# EasyEDA Pro project GigaVGA666PS2.eprj

# Schematic Schematic1
Board Name: Board1; Create Date: 2025-10-13; Page Name: P1; Project Name: GigaVGA666PS2; Schematic Name: Schematic1; Update Date: 2025-10-14; Company: EasyEDA.com; Page Size: A4; Version: V1.0
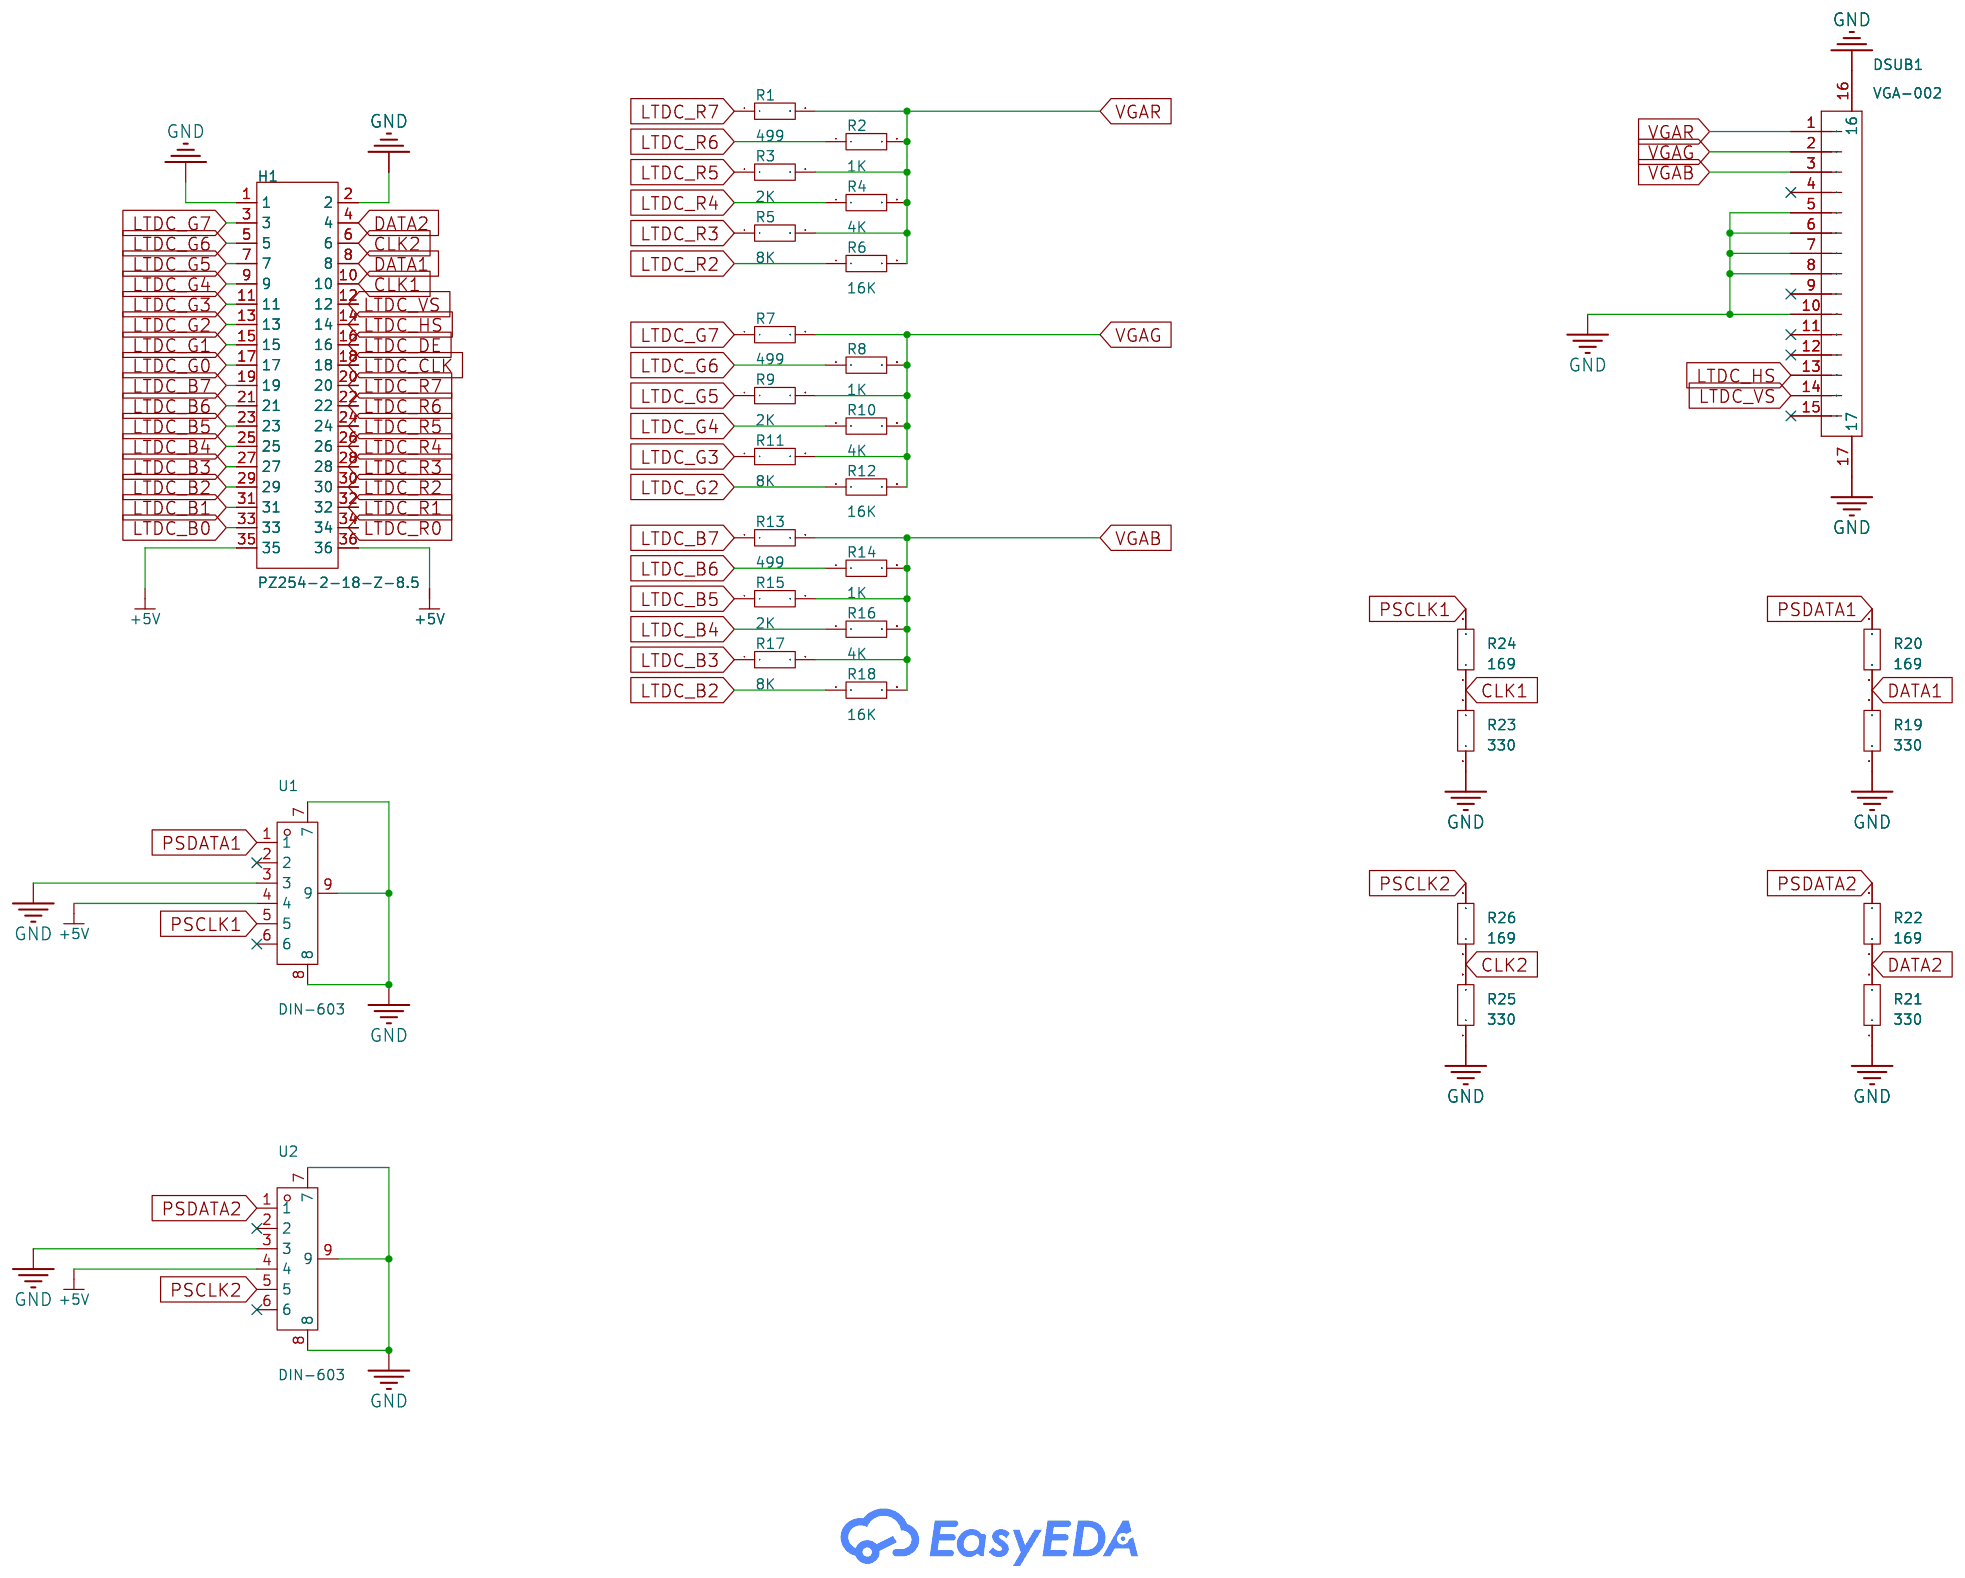
[diagram p0: schematic sheet]

## Parts
DSUB1  VGA-002  [D-SUB-TH_VGA-002]
H1  PZ254-2-18-Z-8.5  [HDR-TH_36P-P2.54-V-M-R2-C18-S2.54]
R1  499  [R0603]
R2  1K  [R0603]
R3  2K  [R0603]
R4  4K  [R0603]
R5  8K  [R0603]
R6  16K  [R0603]
R7  499  [R0603]
R8  1K  [R0603]
R9  2K  [R0603]
R10  4K  [R0603]
R11  8K  [R0603]
R12  16K  [R0603]
R13  499  [R0603]
R14  1K  [R0603]
R15  2K  [R0603]
R16  4K  [R0603]
R17  8K  [R0603]
R18  16K  [R0603]
R19  330  [R0603]
R20  169  [R0603]
R21  330  [R0603]
R22  169  [R0603]
R23  330  [R0603]
R24  169  [R0603]
R25  330  [R0603]
R26  169  [R0603]
U1  DIN-603  [PS2-TH_DIN-603]
U2  DIN-603  [PS2-TH_DIN-603]

## Library data of the parts
DSUB1 = VGA-002: LCSC Part Name: D-Sub 母 P数:15P; Supplier Part: C138387; Manufacturer: BOOMELE(博穆精密); Supplier Footprint: 弯插; JLCPCB Part Class: Extended Part; Datasheet: https://item.szlcsc.com/datasheet/VGA-002/149705.html; Supplier: LCSC; Connector Type: High Density D-Sub; Gender: Female; Number of Pins: 15P; Mounting Type: Right Angle; Number of Rows: 3; Current Rating-Signal: 500mA; Voltage Rating: 30V; Color: Blue
H1 = PZ254-2-18-Z-8.5_C2894979: LCSC Part Name: 2x18P 间距:2.54mm 方针 直插; Supplier Part: C2894979; Manufacturer: HCTL(华灿天禄); Supplier Footprint: 插件,P=2.54mm; JLCPCB Part Class: Extended Part; Datasheet: https://atta.szlcsc.com/upload/public/pdf/source/20230609/5BA09C8BEB9B31376F8BF6032FF67CAC.pdf; Supplier: LCSC; Pin Structure: 2x18P; Pitch: 2.54mm; Row Spacing: 2.54mm; Circluar Pins/Square Pins: Policy; Mounting Type: Straight; Number of Rows: Double Row; Number of Pins: 36P; Current Rating: 3A; Length of Mating Pin: 6mm; Insulation Height: 2.5mm; Length of End Connection Pin: 3mm; Contact Material: Brass; Operating Temperature: -40℃~+105℃; Color: Black
R1-R26 = Res_0603: Supplier Footprint: 0603
U1 U2 = DIN-603_C23689424: LCSC Part Name: DIN插座; Supplier Part: C23689424; Manufacturer: Legion(六钧); Supplier Footprint: 插件; JLCPCB Part Class: Extended Part; Datasheet: https://atta.szlcsc.com/upload/public/pdf/source/20240702/0160C5086853E535507D1610542C9395.pdf; Supplier: LCSC

## Nets
+5V: H1.35 H1.36 U1.4 U2.4
GND: DSUB1.5 DSUB1.6 DSUB1.7 DSUB1.8 DSUB1.10 DSUB1.16 DSUB1.17 H1.1 H1.2 R19.1 R21.1 R23.1 R25.1 U1.3 U1.7 U1.8 U1.9 U2.3 U2.7 U2.8 U2.9
CLK1: H1.10 R23.2 R24.1
CLK2: H1.6 R25.2 R26.1
DATA1: H1.8 R19.2 R20.1
DATA2: H1.4 R21.2 R22.1
LTDC_B0: H1.33
LTDC_B1: H1.31
LTDC_B2: H1.29 R18.1
LTDC_B3: H1.27 R17.1
LTDC_B4: H1.25 R16.1
LTDC_B5: H1.23 R15.1
LTDC_B6: H1.21 R14.1
LTDC_B7: H1.19 R13.1
LTDC_CLK: H1.18
LTDC_DE: H1.16
LTDC_G0: H1.17
LTDC_G1: H1.15
LTDC_G2: H1.13 R12.1
LTDC_G3: H1.11 R11.1
LTDC_G4: H1.9 R10.1
LTDC_G5: H1.7 R9.1
LTDC_G6: H1.5 R8.1
LTDC_G7: H1.3 R7.1
LTDC_HS: DSUB1.13 H1.14
LTDC_R0: H1.34
LTDC_R1: H1.32
LTDC_R2: H1.30 R6.1
LTDC_R3: H1.28 R5.1
LTDC_R4: H1.26 R4.1
LTDC_R5: H1.24 R3.1
LTDC_R6: H1.22 R2.1
LTDC_R7: H1.20 R1.1
LTDC_VS: DSUB1.14 H1.12
PSCLK1: R24.2 U1.5
PSCLK2: R26.2 U2.5
PSDATA1: R20.2 U1.1
PSDATA2: R22.2 U2.1
VGAB: DSUB1.3 R13.2 R14.2 R15.2 R16.2 R17.2 R18.2
VGAG: DSUB1.2 R7.2 R8.2 R9.2 R10.2 R11.2 R12.2
VGAR: DSUB1.1 R1.2 R2.2 R3.2 R4.2 R5.2 R6.2

Not connected (* = marked no-connect by the designer): DSUB1 4* 9* 11* 12* 15*; U1 2* 6*; U2 2* 6*

# Board PCB1
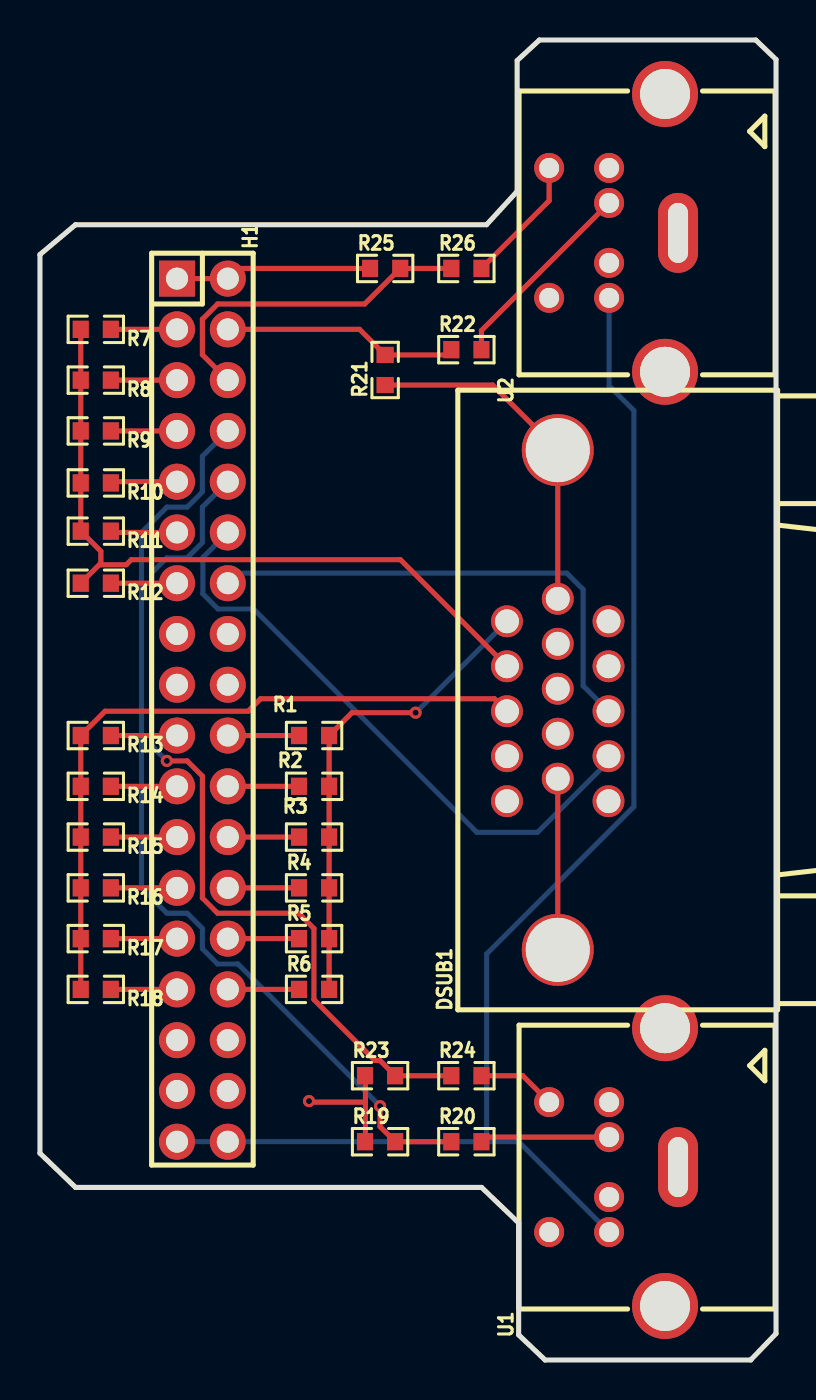
[diagram p1: board, top side]
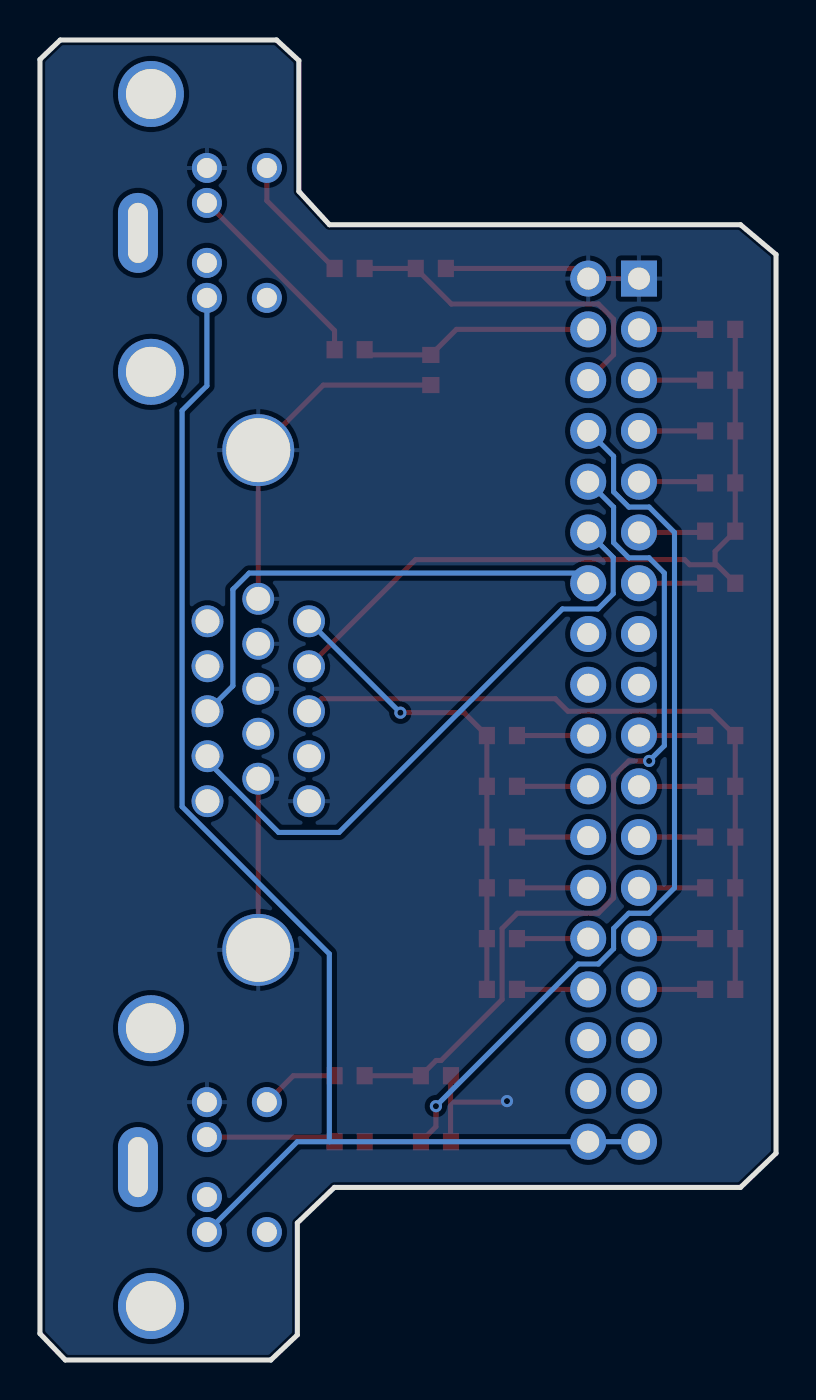
[diagram p2: board, bottom side, seen from below]

Outline 36.83 x 66.04 mm; copper layers: Top Layer, Bottom Layer. Coordinates in mm from the lower left corner of the outline.
Outline path: 0,55.31 1.78,56.8 22.34,56.8 23.88,58.47 23.88,65.01 24.99,66.04 35.81,66.04 36.83,65.06 36.83,1.32 35.56,0 25.28,0 23.95,1.26 23.95,6.86 22.1,8.64 1.78,8.64 0,10.34 0,55.31
Stack: Top Layer 0.035mm / Dielectric1 1.51mm FR4 er 4.5 / Bottom Layer 0.035mm

## Design rules (mm)
template: Custom Config
spacing copperThickness1oz (default): track to track 0.102, other pairs 0.152 to 0.3
spacing copperThickness2oz: track to track 0.203, other pairs 0.152 to 0.3
track width copperThickness1oz (default): min 0.127, default 0.254, max 2.54
track width copperThickness2oz: min 0.127, default 0.254, max 2.54
differential pair differentialPair (default): width min 0.127, default 0.254, max 2.54; gap min 0.152, default 0.152
via viaSize (default): diameter min 0.5, default 0.61, max 10; hole min 0.3, default 0.305, max 6.3
net GND uses copperThickness2oz

## Placement (name value [footprint] x y rotation side)
DSUB1  VGA-002  [D-SUB-TH_VGA-002]  25.91 33.02 90 top
H1  PZ254-2-18-Z-8.5  [HDR-TH_36P-P2.54-V-M-R2-C18-S2.54]  8.13 32.51 270 top
R1  499  [R0603]  13.72 31.24 0 top
R2  1K  [R0603]  13.72 28.7 0 top
R3  2K  [R0603]  13.72 26.16 0 top
R4  4K  [R0603]  13.72 23.62 0 top
R5  8K  [R0603]  13.72 21.08 0 top
R6  16K  [R0603]  13.72 18.54 0 top
R7  499  [R0603]  2.79 51.56 180 top
R8  1K  [R0603]  2.79 49.02 180 top
R9  2K  [R0603]  2.79 46.48 180 top
R10  4K  [R0603]  2.79 43.88 180 top
R11  8K  [R0603]  2.79 41.47 180 top
R12  16K  [R0603]  2.79 38.86 180 top
R13  499  [R0603]  2.79 31.24 180 top
R14  1K  [R0603]  2.79 28.7 180 top
R15  2K  [R0603]  2.79 26.16 180 top
R16  4K  [R0603]  2.79 23.62 180 top
R17  8K  [R0603]  2.79 21.08 180 top
R18  16K  [R0603]  2.79 18.54 180 top
R19  330  [R0603]  17.02 10.92 0 top
R20  169  [R0603]  21.34 10.92 0 top
R21  330  [R0603]  17.27 49.53 90 top
R22  169  [R0603]  21.34 50.55 0 top
R23  330  [R0603]  17.02 14.22 0 top
R24  169  [R0603]  21.34 14.22 0 top
R25  330  [R0603]  17.27 54.61 0 top
R26  169  [R0603]  21.34 54.61 0 top
U1  DIN-603  [PS2-TH_DIN-603]  28.7 9.65 90 top
U2  DIN-603  [PS2-TH_DIN-603]  28.7 56.39 90 top

## Footprints (pads in the part's own frame, mm; a bottom-side part is the same pattern mirrored in y, then rotated)
D-SUB-TH_VGA-002
  round 1.593 hole 1.194: 1(3.938,2.54) 2(1.688,2.54) 3(-0.562,2.54) 4(-2.812,2.54) 5(-5.062,2.54) 6(5.062,0) 7(2.812,0) 8(0.562,0) 9(-1.688,0) 10(-3.938,0) 11(3.938,-2.54) 12(1.688,-2.54) 13(-0.562,-2.54) 14(-2.812,-2.54) 15(-5.062,-2.54)
  round 3.599 hole 3.2: 16(12.5,0) 17(-12.5,0)
HDR-TH_36P-P2.54-V-M-R2-C18-S2.54
  rect 1.8x1.8 hole 1.1: 1(-21.59,-1.27)
  round 1.8 hole 1.1: 2(-21.59,1.27) 3(-19.05,-1.27) 4(-19.05,1.27) 5(-16.51,-1.27) 6(-16.51,1.27) 7(-13.97,-1.27) 8(-13.97,1.27) 9(-11.43,-1.27) 10(-11.43,1.27) 11(-8.89,-1.27) 12(-8.89,1.27) 13(-6.35,-1.27) 14(-6.35,1.27) 15(-3.81,-1.27) 16(-3.81,1.27) 17(-1.27,-1.27) 18(-1.27,1.27) 19(1.27,-1.27) 20(1.27,1.27) 21(3.81,-1.27) 22(3.81,1.27) 23(6.35,-1.27) 24(6.35,1.27) 25(8.89,-1.27) 26(8.89,1.27) 27(11.43,-1.27) 28(11.43,1.27) 29(13.97,-1.27) 30(13.97,1.27) 31(16.51,-1.27) 32(16.51,1.27) 33(19.05,-1.27) 34(19.05,1.27) 35(21.59,-1.27) 36(21.59,1.27)
PS2-TH_DIN-603
  round 3.3 hole 2.5: 0(-6.95,-2.575) 0(6.95,-2.575)
  oval 4x2 hole 3x1: 0(0,-3.225)
  round 1.5 hole 1: 1(1.5,0.225) 2(-1.5,0.225) 3(3.25,0.225) 4(-3.25,0.225) 5(3.25,3.225) 6(-3.25,3.225)
R0603
  rect 0.806x0.864 smd: 1(-0.753,0) 2(0.753,0)

## Nets
As in the schematic, except:
GND: DSUB1.5 DSUB1.6 DSUB1.7 DSUB1.8 DSUB1.10 DSUB1.16 DSUB1.17 H1.1 H1.2 R19.1 R21.1 R23.1 R25.1 U1.3 U2.3

Pads without a net: DSUB1 4 9 11 12 15; U1 0 2 6; U2 0 2 6

## Via types
v1: diameter 0.61, hole 0.305, Top Layer to Bottom Layer, 4 vias

## Routing (per net, layer and track width the routed paths; a pad name or vN(x,y) marks a point on that pad's centre or on a via; arc(x,y) is an arc through that point)
+5V: length 69.3
  Bottom Layer w0.254: 22.35,10.92 22.35,20.32 29.72,27.69 29.72,47.5 28.48,48.74 U2.4 ; 22.35,10.92 23.96,10.92 U1.4 ; 22.35,10.92 H1.36 H1.35
GND: length 42
  Top Layer w0.254: 16.28,12.9 13.51,12.9 v1(13.46,12.95) ; 16.28,12.9 16.28,14.2 R23.1 ; 16.28,12.9 16.28,10.94 R19.1 ; DSUB1.10 DSUB1.17 ; R21.1 22.65,48.78 DSUB1.16 DSUB1.6 ; H1.1 H1.2 9.91,54.61 R25.1
CLK1: length 42.9
  Top Layer w0.254: R24.1 R23.2 17.01,14.99 16.76,14.99 13.71,18.03 13.71,21.59 12.95,22.35 8.89,22.35 8.13,23.11 8.13,29.21 7.37,29.97 v1(6.35,29.97)
  Bottom Layer w0.254: v1(6.35,29.97) 5.59,30.73 5.59,39.37 6.35,40.13 7.37,40.13 8.13,40.89 8.13,42.67 H1.10
CLK2: length 17.1
  Top Layer w0.254: H1.6 8.13,50.29 8.13,52.07 8.89,52.83 16.25,52.83 R25.2 R26.1
DATA1: length 47.2
  Top Layer w0.254: R20.1 R19.2 17.02,11.68 v1(17.02,12.7)
  Bottom Layer w0.254: v1(17.02,12.7) 9.91,19.81 8.89,19.81 8.13,20.57 8.13,21.59 7.37,22.35 6.35,22.35 5.08,23.62 5.08,41.4 6.35,42.67 7.37,42.67 8.13,43.43 8.13,45.21 H1.8
DATA2: length 11.8
  Top Layer w0.254: R22.1 20.32,50.28 R21.2 15.99,51.56 H1.4
LTDC_B2: length 3.3
  Top Layer w0.254: H1.29 R18.1
LTDC_B3: length 3.3
  Top Layer w0.254: H1.27 R17.1
LTDC_B4: length 3.3
  Top Layer w0.254: H1.25 R16.1
LTDC_B5: length 3.3
  Top Layer w0.254: H1.23 R15.1
LTDC_B6: length 3.3
  Top Layer w0.254: H1.21 R14.1
LTDC_B7: length 3.3
  Top Layer w0.254: H1.19 R13.1
LTDC_G2: length 3.3
  Top Layer w0.254: H1.13 R12.1
LTDC_G3: length 3.3
  Top Layer w0.254: R11.1 3.61,41.4 H1.11
LTDC_G4: length 3.3
  Top Layer w0.254: H1.9 3.61,43.94 R10.1
LTDC_G5: length 3.3
  Top Layer w0.254: H1.7 R9.1
LTDC_G6: length 3.3
  Top Layer w0.254: H1.5 R8.1
LTDC_G7: length 3.3
  Top Layer w0.254: H1.3 R7.1
LTDC_HS: length 25
  Bottom Layer w0.254: H1.14 9.91,39.37 26.36,39.37 27.18,38.55 27.18,33.73 DSUB1.13
LTDC_R2: length 3.6
  Top Layer w0.254: H1.30 R6.1
LTDC_R3: length 3.6
  Top Layer w0.254: H1.28 R5.1
LTDC_R4: length 3.6
  Top Layer w0.254: H1.26 R4.1
LTDC_R5: length 3.6
  Top Layer w0.254: H1.24 R3.1
LTDC_R6: length 3.6
  Top Layer w0.254: H1.22 R2.1
LTDC_R7: length 3.6
  Top Layer w0.254: H1.20 R1.1
LTDC_VS: length 30.6
  Bottom Layer w0.254: H1.12 8.15,40.15 8.15,38.34 8.91,37.57 10.69,37.57 21.86,26.4 24.89,26.4 28.45,29.95 DSUB1.14
PSCLK1: length 3.9
  Top Layer w0.254: R24.2 24.16,14.22 U1.5
PSCLK2: length 6.4
  Top Layer w0.254: U2.5 25.48,58 R26.2
PSDATA1: length 6.5
  Top Layer w0.254: R20.2 22.32,11.15 U1.1
PSDATA2: length 10
  Top Layer w0.254: U2.1 22.09,51.5 R22.2
VGAB: length 35
  Top Layer w0.254: R18.2 R17.2 R16.2 R15.2 R14.2 R13.2 3.26,32.46 10.41,32.46 11.04,33.08 22.74,33.08 DSUB1.3
VGAG: length 36.2
  Top Layer w0.254: 3.05,39.79 3.05,40.46 R11.2 R10.2 R9.2 R8.2 R7.2 ; 3.05,39.79 2.97,39.79 R12.2 ; 3.05,39.79 4.32,39.79 4.57,40.04 18.03,40.04 DSUB1.2
VGAR: length 24
  Top Layer w0.254: R6.2 R5.2 R4.2 R3.2 R2.2 R1.2 15.61,32.39 v1(18.8,32.39)
  Bottom Layer w0.254: DSUB1.1 v1(18.8,32.39)

## Copper pours and planes (outline as drawn; the poured copper is in the pictures)
GND on Bottom Layer: 23.83,1.26 23.83,6.86 21.97,8.64 1.65,8.64 -0.13,10.34 -0.13,55.31 1.65,56.8 22.22,56.8 23.75,58.47 23.75,65.01 24.87,66.04 35.69,66.04 36.7,65.06 36.7,1.32 35.43,0 25.15,0
